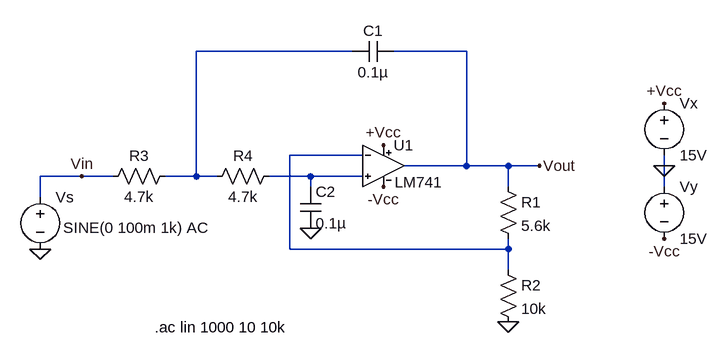
[diagram p0: schematic LPF.asc]
LPF.asc, the LTspice schematic file:
Version 4
SHEET 1 880 680
WIRE 144 -16 -96 -16
WIRE 320 -16 208 -16
WIRE 160 144 48 144
WIRE 320 160 320 -16
WIRE 320 160 224 160
WIRE 384 160 320 160
WIRE 432 160 384 160
WIRE 624 160 624 144
WIRE -272 176 -336 176
WIRE -224 176 -272 176
WIRE -96 176 -96 -16
WIRE -96 176 -144 176
WIRE -64 176 -96 176
WIRE 80 176 16 176
WIRE 160 176 80 176
WIRE 80 192 80 176
WIRE 384 192 384 160
WIRE 624 192 624 160
WIRE -336 208 -336 176
WIRE 48 288 48 144
WIRE 384 288 384 272
WIRE 384 288 48 288
WIRE 384 320 384 288
FLAG 624 160 0
FLAG 624 64 +Vcc
FLAG 624 272 -Vcc
FLAG 80 256 0
FLAG 384 400 0
FLAG 192 128 +Vcc
FLAG 192 192 -Vcc
FLAG 432 160 Vout
FLAG -336 288 0
FLAG -272 176 Vin
SYMBOL LM741 192 96 R0
SYMATTR InstName U1
SYMBOL voltage 624 48 R0
SYMATTR InstName Vx
SYMATTR Value 15V
SYMBOL voltage 624 176 R0
SYMATTR InstName Vy
SYMATTR Value 15V
SYMBOL res 368 176 R0
SYMATTR InstName R1
SYMATTR Value 5.6k
SYMBOL res 368 304 R0
SYMATTR InstName R2
SYMATTR Value 10k
SYMBOL res 32 160 R90
WINDOW 0 0 56 VBottom 2
WINDOW 3 32 56 VTop 2
SYMATTR InstName R4
SYMATTR Value 4.7k
SYMBOL res -128 160 R90
WINDOW 0 0 56 VBottom 2
WINDOW 3 32 56 VTop 2
SYMATTR InstName R3
SYMATTR Value 4.7k
SYMBOL cap 208 -32 R90
WINDOW 0 0 32 VBottom 2
WINDOW 3 32 32 VTop 2
SYMATTR InstName C1
SYMATTR Value 0.1µ
SYMBOL cap 64 192 R0
SYMATTR InstName C2
SYMATTR Value 0.1µ
SYMBOL voltage -336 192 R0
WINDOW 3 35 63 Left 2
WINDOW 123 24 124 Left 2
WINDOW 39 0 0 Left 2
SYMATTR Value SINE(0 100m 1k) AC
SYMATTR InstName Vs
TEXT -160 408 Left 2 !.ac lin 1000 10 10k

The netlist it stands for:
* LPF.asc
XU1 N003 N002 +Vcc -Vcc Vout LM741  ; pins In+ In- V+ V- OUT
Vx +Vcc 0 15V
Vy 0 -Vcc 15V
R1 Vout N002 5.6k
R2 N002 0 10k
R4 N003 N001 4.7k
R3 N001 Vin 4.7k
C1 Vout N001 0.1µ
C2 N003 0 0.1µ
Vs Vin 0 SINE(0 100m 1k) AC
.ac lin 1000 10 10k
.lib LM741.lib
.backanno
.end